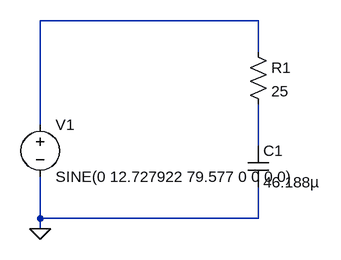
[diagram p0: schematic scheme3.asc]
scheme3.asc, the LTspice schematic file:
Version 4
SHEET 1 880 680
WIRE 512 48 176 48
WIRE 512 96 512 48
WIRE 176 208 176 48
WIRE 512 240 512 176
WIRE 176 352 176 288
WIRE 512 352 512 304
WIRE 512 352 176 352
WIRE 176 368 176 352
FLAG 176 368 0
SYMBOL voltage 176 192 R0
WINDOW 123 0 0 Left 0
WINDOW 39 0 0 Left 0
SYMATTR InstName V1
SYMATTR Value SINE(0 12.727922 79.577 0 0 0 0)
SYMBOL res 496 80 R0
SYMATTR InstName R1
SYMATTR Value 25
SYMBOL cap 496 240 R0
SYMATTR InstName C1
SYMATTR Value 46.188µ

The netlist it stands for:
* scheme3.asc
V1 N001 0 SINE(0 12.727922 79.577 0 0 0 0)
R1 N001 N002 25
C1 N002 0 46.188µ
.backanno
.end